# EAGLE design Thruster Ctl (EAGLE 6.6.0)
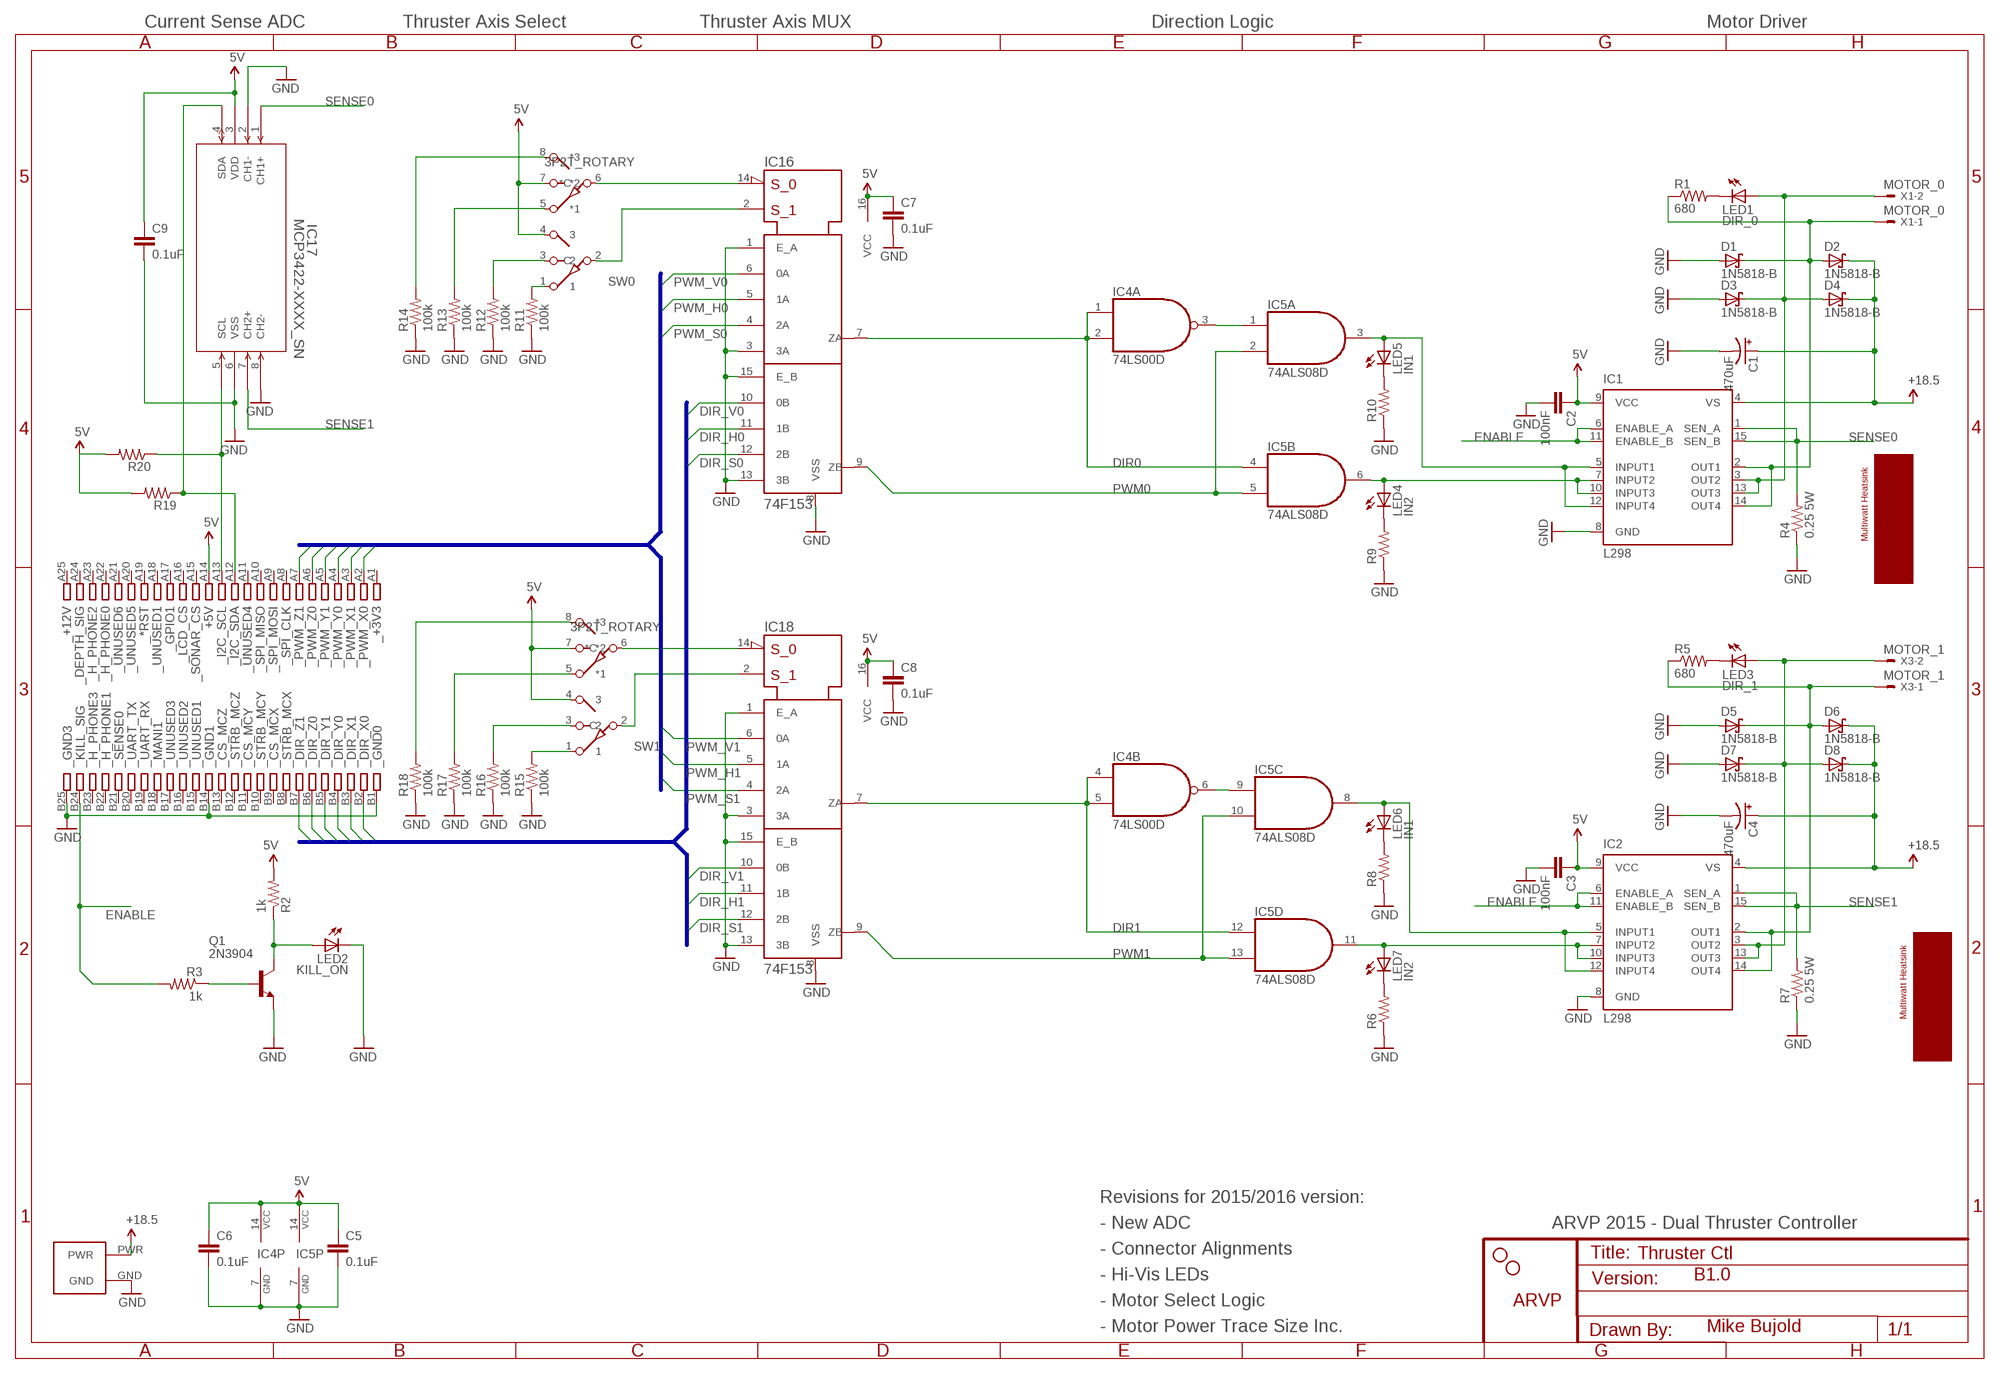
[diagram p0: schematic, sheet 1]

## Parts
C1  470uF  CPOL-USE25-10AXIAL  [E25-10]
C2  100nF  CAPPTH  [CAP-PTH-SMALL]
C3  100nF  CAPPTH  [CAP-PTH-SMALL]
C4  470uF  CPOL-USE25-10AXIAL  [E25-10]
C5  0.1uF  CAP1206  [1206]
C6  0.1uF  CAP1206  [1206]
C7  0.1uF  CAP1206  [1206]
C8  0.1uF  CAP1206  [1206]
C9  0.1uF  CAP1206  [1206]
D1  1N5818-B  [DO41-7.6]
D2  1N5818-B  [DO41-7.6]
D3  1N5818-B  [DO41-7.6]
D4  1N5818-B  [DO41-7.6]
D5  1N5818-B  [DO41-7.6]
D6  1N5818-B  [DO41-7.6]
D7  1N5818-B  [DO41-7.6]
D8  1N5818-B  [DO41-7.6]
IC1  L298  [MULTIWATT-15]
IC2  L298  [MULTIWATT-15]
IC4  74LS00D  [SO14]
IC5  74ALS08D  [SO14]
IC16  74F153  [SO16]
IC17  MCP3422-XXXX_SN  [SOIC8-N_MC]
IC18  74F153  [SO16]
JP1  STAND-OFF  [STAND-OFF]
JP4  STAND-OFF  [STAND-OFF]
LED1  DIR_0  LED5MM  [LED5MM]
LED2  KILL_ON  LED5MM  [LED5MM]
LED3  DIR_1  LED5MM  [LED5MM]
LED4  IN2  LEDSMT1206  [1206]
LED5  IN1  LEDSMT1206  [1206]
LED6  IN1  LEDSMT1206  [1206]
LED7  IN2  LEDSMT1206  [1206]
Q1  2N3904  [TO92]
R1  680  RESISTORPTH-1/4W  [AXIAL-0.4]
R2  1k  RESISTORPTH-1/4W  [AXIAL-0.4]
R3  1k  RESISTORPTH-1/4W  [AXIAL-0.4]
R4  0.25 5W  RESISTOR  [0922/22]
R5  680  RESISTORPTH-1/4W  [AXIAL-0.4]
R6  RESISTOR1206  [1206]
R7  0.25 5W  RESISTOR  [0922/22]
R8  RESISTOR1206  [1206]
R9  RESISTOR1206  [1206]
R10  RESISTOR1206  [1206]
R11  100k  RESISTOR1206  [1206]
R12  100k  RESISTOR1206  [1206]
R13  100k  RESISTOR1206  [1206]
R14  100k  RESISTOR1206  [1206]
R15  100k  RESISTOR1206  [1206]
R16  100k  RESISTOR1206  [1206]
R17  100k  RESISTOR1206  [1206]
R18  100k  RESISTOR1206  [1206]
R19  RESISTOR1206  [1206]
R20  RESISTOR1206  [1206]
SW0  3P2T_ROTARY  [DIL08]
SW1  3P2T_ROTARY  [DIL08]
U$4  ARVP_LOGO  [ARVP]
U$7  AND_PWR  [AND_PWR]
U$9  L298_HS  [HEATSINK_MW]
U$10  L298_HS  [HEATSINK_MW]
U$19  CARD_50PIN  [CARD_50PIN]
X1  MOTOR_0  KK-156-2  [KK-156-2]
X3  MOTOR_1  KK-156-2  [KK-156-2]

## Nets
5V: C2.1 C3.1 C5.1 C6.1 C7.1 C8.1 C9.1 IC1.9(VCC) IC2.9(VCC) IC4.14(P:VCC) IC5.14(P:VCC) IC16.16(VCC) IC17.3(VDD) IC18.16(VCC) R2.P$2 R19.2 R20.2 SW0.4 SW0.7(*2) SW1.4 SW1.7(*2) U$19.A14
18.5V: C1.+ C4.+ D2.C D4.C D6.C D8.C IC1.4(VS) IC2.4(VS) U$7.PWR ; supply symbol labelled +18.5
DIR0: IC4.1(A:I0) IC4.2(A:I1) IC5.4(B:I0) IC16.7(ZA)
DIR1: IC4.4(B:I0) IC4.5(B:I1) IC5.12(D:I0) IC18.7(ZA)
DIR_H0: IC16.11(1B) U$19.B4
DIR_H1: IC18.11(1B) U$19.B5
DIR_S0: IC16.12(2B) U$19.B6
DIR_S1: IC18.12(2B) U$19.B7
DIR_V0: IC16.10(0B) U$19.B2
DIR_V1: IC18.10(0B) U$19.B3
ENABLE: IC1.6(ENABLE_A) IC1.11(ENABLE_B) IC2.6(ENABLE_A) IC2.11(ENABLE_B) R3.P$2 U$19.B24
GND: C1.- C2.2 C3.2 C4.- C5.2 C6.2 C7.2 C8.2 C9.2 D1.A D3.A D5.A D7.A IC1.8(GND) IC2.8(GND) IC4.7(P:GND) IC5.7(P:GND) IC16.1(E_A) IC16.3(3A) IC16.8(VSS) IC16.13(3B) IC16.15(E_B) IC17.2(CH1-) IC17.6(VSS) IC17.8(CH2-) IC18.1(E_A) IC18.3(3A) IC18.8(VSS) IC18.13(3B) IC18.15(E_B) LED2.K(C) Q1.3(E) R4.1 R6.1 R7.1 R8.1 R9.1 R10.1 R11.1 R12.1 R13.1 R14.1 R15.1 R16.1 R17.1 R18.1 U$7.GND U$19.B1 U$19.B14 U$19.B25
N$1: IC16.14(S0) SW0.6(*C)
N$2: R13.2 SW0.5(*1)
N$3: LED2.A Q1.1(C) R2.P$1
N$4: IC2.5(INPUT1) IC2.12(INPUT4) IC5.8(C:O) LED6.A
N$5: IC1.5(INPUT1) IC1.12(INPUT4) IC5.3(A:O) LED5.A
N$6: IC1.7(INPUT2) IC1.10(INPUT3) IC5.6(B:O) LED4.A
N$7: D1.C D2.A IC1.2(OUT1) IC1.14(OUT4) R1.P$1 X1.1
N$8: D3.C D4.A IC1.3(OUT2) IC1.13(OUT3) LED1.A X1.2
N$9: LED1.K(C) R1.P$2
N$10: IC18.14(S0) SW1.6(*C)
N$11: D5.C D6.A IC2.2(OUT1) IC2.14(OUT4) R5.P$1 X3.1
N$12: D7.C D8.A IC2.3(OUT2) IC2.13(OUT3) LED3.A X3.2
N$13: R11.2 SW0.1
N$14: LED3.K(C) R5.P$2
N$15: IC16.2(S1) SW0.2(C)
N$16: IC18.2(S1) SW1.2(C)
N$18: LED7.C R6.2
N$19: LED6.C R8.2
N$20: LED4.C R9.2
N$21: LED5.C R10.2
N$22: IC17.5(SCL) R20.1 U$19.A13
N$23: IC17.4(SDA) R19.1 U$19.A12
N$24: R12.2 SW0.3
N$25: IC4.6(B:O) IC5.9(C:I0)
N$26: R14.2 SW0.8(*3)
N$27: IC4.3(A:O) IC5.1(A:I0)
N$28: Q1.2(B) R3.P$1
N$30: IC2.7(INPUT2) IC2.10(INPUT3) IC5.11(D:O) LED7.A
N$31: R17.2 SW1.5(*1)
N$32: R15.2 SW1.1
N$33: R16.2 SW1.3
N$34: R18.2 SW1.8(*3)
PWM0: IC5.2(A:I1) IC5.5(B:I1) IC16.9(ZB)
PWM1: IC5.10(C:I1) IC5.13(D:I1) IC18.9(ZB)
PWM_H0: IC16.5(1A) U$19.A4
PWM_H1: IC18.5(1A) U$19.A5
PWM_S0: IC16.4(2A) U$19.A6
PWM_S1: IC18.4(2A) U$19.A7
PWM_V0: IC16.6(0A) U$19.A2
PWM_V1: IC18.6(0A) U$19.A3
SENSE0: IC1.1(SEN_A) IC1.15(SEN_B) IC17.1(CH1+) R4.2
SENSE1: IC2.1(SEN_A) IC2.15(SEN_B) IC17.7(CH2+) R7.2
Unconnected: IC4.8(C:O) IC4.9(C:I0) IC4.10(C:I1) IC4.11(D:O) IC4.12(D:I0) IC4.13(D:I1) U$19.A1 U$19.A8 U$19.A9 U$19.A10 U$19.A11 U$19.A15 U$19.A16 U$19.A17 U$19.A18 U$19.A19 U$19.A20 U$19.A21 U$19.A22 U$19.A23 U$19.A24 U$19.A25 U$19.B8 U$19.B9 U$19.B10 U$19.B11 U$19.B12 U$19.B13 U$19.B15 U$19.B16 U$19.B17 U$19.B18 U$19.B19 U$19.B20 U$19.B21 U$19.B22 U$19.B23

## Buses
PWM_V0,PWM_V1,PWM_H0,PWM_H1,PWM_S0,PWM_S1
DIR_V0,DIR_V1,DIR_H0,DIR_H1,DIR_S0,DIR_S1

## Notes on the sheet
- Current Sense ADC | Thruster Axis Select | Thruster Axis MUX | Direction Logic | Motor Driver
- Revisions for 2015/2016 version:
- - New ADC | ARVP 2015 - Dual Thruster Controller
- - Connector Alignments
- - Hi-Vis LEDs | B1.0
- - Motor Select Logic
- - Motor Power Trace Size Inc. | Mike Bujold

## Library data of the parts
C1 C4 = rcl:CPOL-US: POLARIZED CAPACITOR, American symbol
C2 C3 = SparkFun:CAP: Capacitor Standard 0603 ceramic capacitor, and 0.1" leaded capacitor.
C5-C9 = SparkFun-Capacitors:CAP: Capacitor Standard 0603 ceramic capacitor, and 0.1" leaded capacitor.
D1-D8 = diode:1N581*: 1.0A SCHOTTKY BARRIER RECTIFIER Source: http://www.diodes.com/datasheets/ds23001.pdf
IC1 IC2 = st-microelectronics:L298: DUAL FULL-BRIDGE DRIVER; MPN: L298N; OC_FARNELL: 1589425; OC_NEWARK: 32M1527
IC4 = 74xx-us:74*00: Quad 2-input NAND gate
IC5 = 74xx-us:74*08: Quad 2-input AND gate
IC16 IC18 = ARVP:74F153
IC17 = MCP3426:MCP3422-XXXX_SN
JP1 JP4 = SparkFun:STAND-OFF: Stand Off This is the mechanical footprint for a #4 phillips button head screw. Use the keepout ring to avoid running the screw head into surrounding components. SKU : PRT-00447
LED1-LED3 = led:LED: LED
LED4-LED7 = adafruit:LED: LED
Q1 = transistor-npn:2N3904: NPN Transistor
R1-R3 R5 = SparkFun:RESISTOR: Resistor Basic schematic elements and footprints for 0603, 1206, and PTH resistors.
R4 R7 = virgin:RESISTOR
R6 R8-R20 = SparkFun-Passives:RESISTOR: Resistor Basic schematic elements and footprints for 0603, 1206, and PTH resistors.
SW0 SW1 = ARVP:3P2T_ROTARY
U$4 = ARVP:ARVP_LOGO
U$7 = ARVP:AND_PWR
U$9 U$10 = ARVP:L298_HS
U$19 = ARVP:CARD_50PIN
X1 X3 = con-molex:KK-156-2: KK 156 HEADER Source: http://www.molex.com/pdm_docs/sd/026604100_sd.pdf; OC_FARNELL: unknown; OC_NEWARK: unknown

## Board
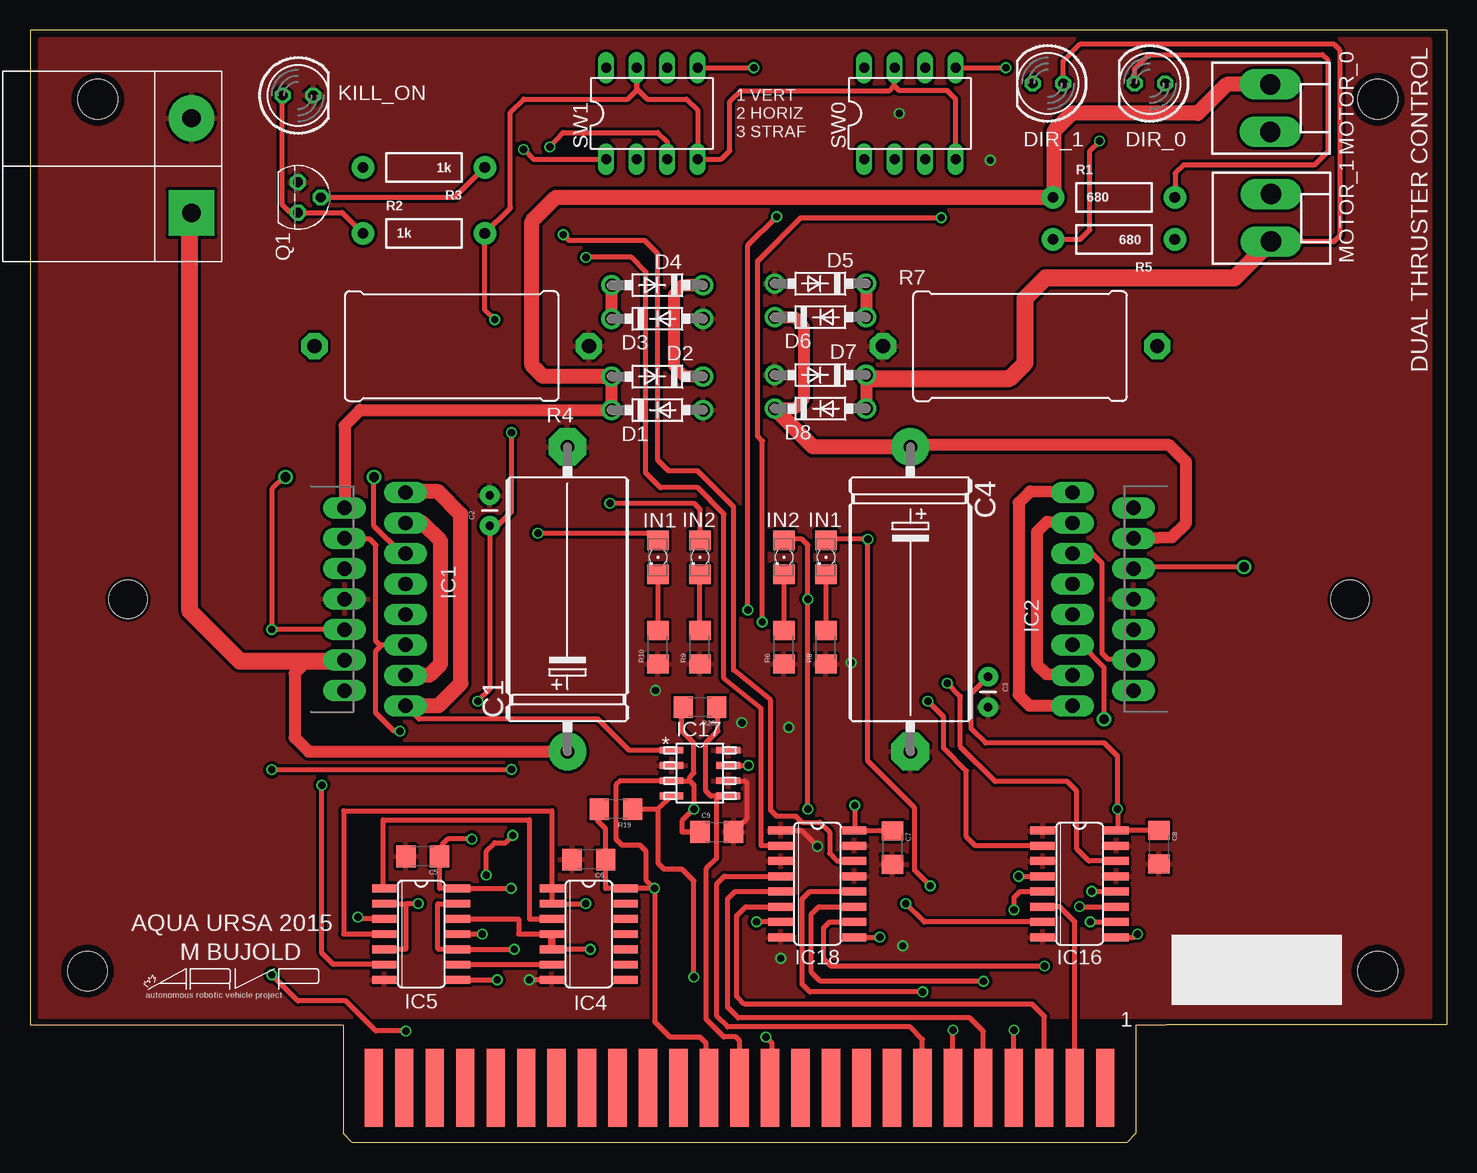
[diagram p1: board, top side]
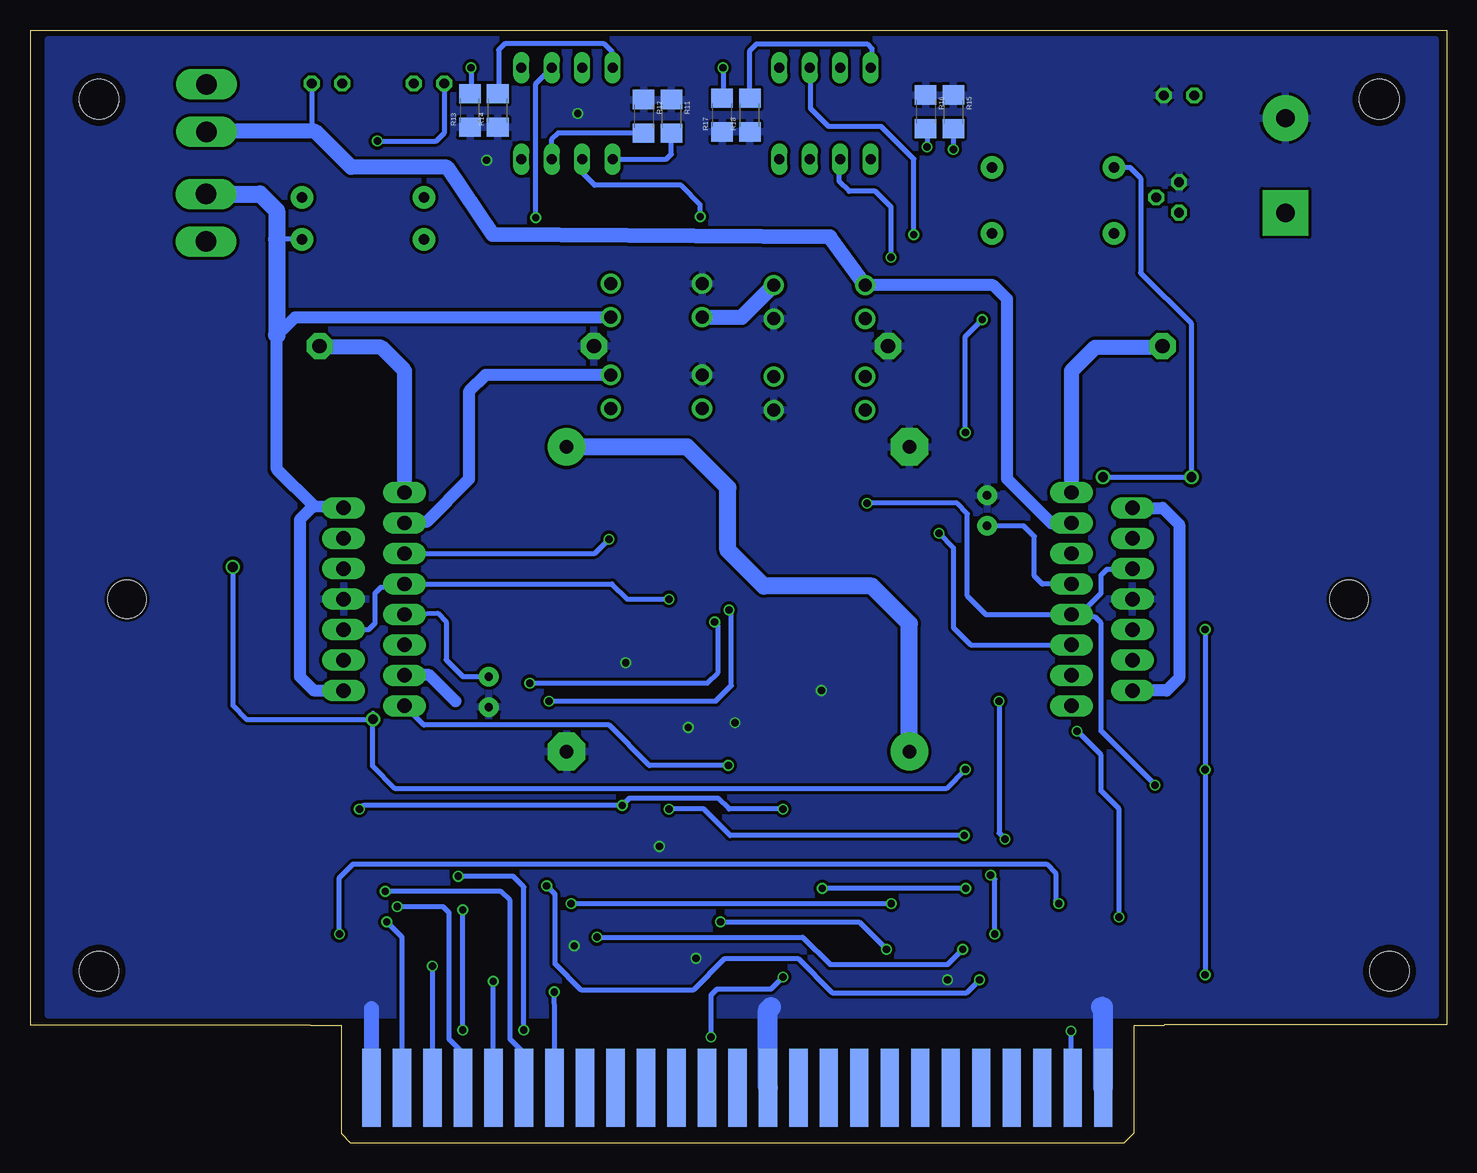
[diagram p2: board, bottom side, seen from below]

Size 118.08 x 92.75 mm. Coordinates in mm from the lower left corner, seen from the top.
Outline: 23.58,9.8 0.01,9.8 0,92.75 118.07,92.75 118.08,9.8 94.68,9.8
Copper layers (1*16): Top 0.035mm / dielectric 1.5mm / Bottom 0.035mm
Design rules "ITEADstudio_DRC": minimum track width 6mil, minimum drill 12mil, track to track 6mil, track to pad 6mil, pad to pad 6mil, via to via 6mil, smd to smd 0mil, copper to edge 10mil, drill to drill 10mil, minimum pad ring 10mil, minimum via ring 6mil, stop-mask expansion 2mil, vias tented up to drill 100mil, thermal gap 10mil

### Footprints (pad centres in the part's own frame; a part is rotated, then mirrored left to right if it is on the bottom)
E25-10 = drill 1.118 pad 3.15: + -12.7,0 | drill 1.118 pad 3.15 octagon: - 12.7,0
CAP-PTH-SMALL = drill 0.7 pad 1.651: 1 0,0; 2 2.54,0
1206 = smd 1.6 x 1.8: 1 -1.4,0; 2 1.4,0
DO41-7.6 = drill 1.1 pad 1.7: A 3.81,0; C -3.81,0
MULTIWATT-15 = drill 1.2 long: 1 -8.89,-7.62; 2 -7.62,-2.54; 3 -6.35,-7.62; 4 -5.08,-2.54; 5 -3.81,-7.62; 6 -2.54,-2.54; 7 -1.27,-7.62; 8 0,-2.54; 9 1.27,-7.62; 10 2.54,-2.54; 11 3.81,-7.62; 12 5.08,-2.54; 13 6.35,-7.62; 14 7.62,-2.54; 15 8.89,-7.62
SO14 = smd 0.66 x 2.032: 1 -3.81,-3.073; 2 -2.54,-3.073; 3 -1.27,-3.073; 4 0,-3.073; 5 1.27,-3.073; 6 2.54,-3.073; 7 3.81,-3.073; 8 3.81,3.073; 9 2.54,3.073; 10 1.27,3.073; 11 0,3.073; 12 -1.27,3.073; 13 -2.54,3.073; 14 -3.81,3.073
SO16 = smd 0.66 x 2.032: 1 -4.445,-3.073; 2 -3.175,-3.073; 3 -1.905,-3.073; 4 -0.635,-3.073; 5 0.635,-3.073; 6 1.905,-3.073; 7 3.175,-3.073; 8 4.445,-3.073; 9 4.445,3.073; 10 3.175,3.073; 11 1.905,3.073; 12 0.635,3.073; 13 -0.635,3.073; 14 -1.905,3.073; 15 -3.175,3.073; 16 -4.445,3.073
SOIC8-N_MC = smd 1.981 x 0.559: 1 -2.362,1.905; 2 -2.362,0.635; 3 -2.362,-0.635; 4 -2.362,-1.905; 5 2.362,-1.905; 6 2.362,-0.635; 7 2.362,0.635; 8 2.362,1.905
STAND-OFF = hole 3.302: 0,0
LED5MM = drill 0.813 octagon: A -1.27,0; K 1.27,0
1206' = smd 1.6 x 1.803: A -1.422,0; C 1.422,0
TO92 = drill 0.813 octagon: 1 1.27,0; 2 0,1.905; 3 -1.27,0
AXIAL-0.4 = drill 0.9 pad 1.88: P$1 -5.08,0; P$2 5.08,0
0922/22 = drill 1.2 pad 2.184 octagon: 1 -11.43,0; 2 11.43,0
DIL08 = drill 0.813 long: 1 -3.81,-3.81; 2 -1.27,-3.81; 3 1.27,-3.81; 4 3.81,-3.81; 5 3.81,3.81; 6 1.27,3.81; 7 -1.27,3.81; 8 -3.81,3.81
AND_PWR = drill 1.524 pad 3.81: GND 0,-7.886 | drill 1.524 pad 3.81 square: PWR 0,0
HEATSINK_MW = hole 3.2: 0,12.319
CARD_50PIN = smd 1.524 x 6.477: A1 30.48,5.08; A2 27.94,5.08; A3 25.4,5.08; A4 22.86,5.08; A5 20.32,5.08; A6 17.78,5.08; A7 15.24,5.08; A8 12.7,5.08; A9 10.16,5.08; A10 7.62,5.08; A11 5.08,5.08; A12 2.54,5.08; A13 0,5.08; A14 -2.54,5.08; A15 -5.08,5.08; A16 -7.62,5.08; A17 -10.16,5.08; A18 -12.7,5.08; A19 -15.24,5.08; A20 -17.78,5.08; A21 -20.32,5.08; A22 -22.86,5.08; A23 -25.4,5.08; A24 -27.94,5.08; A25 -30.48,5.08 | smd 1.524 x 6.477 bottom: B1 30.48,5.08; B2 27.94,5.08; B3 25.4,5.08; B4 22.86,5.08; B5 20.32,5.08; B6 17.78,5.08; B7 15.24,5.08; B8 12.7,5.08; B9 10.16,5.08; B10 7.62,5.08; B11 5.08,5.08; B12 2.54,5.08; B13 0,5.08; B14 -2.54,5.08; B15 -5.08,5.08; B16 -7.62,5.08; B17 -10.16,5.08; B18 -12.7,5.08; B19 -15.24,5.08; B20 -17.78,5.08; B21 -20.32,5.08; B22 -22.86,5.08; B23 -25.4,5.08; B24 -27.94,5.08; B25 -30.48,5.08
KK-156-2 = drill 1.7 pad 2.184 long: 1 -1.98,0; 2 1.98,0

### Placement (x,y rotation side)
C1  44.79,45.3 90 top
C2  38.31,51.41 90 top
C3  79.84,38.84 270 top
C4  73.37,45.3 270 top
C5  32.73,23.85 180 top
C6  46.57,23.6 180 top
C7  71.87,24.59 270 top
C8  94.07,24.63 270 top
C9  57.23,25.9 0 top
D1  52.28,61.06 0 top
D2  52.28,63.86 180 top
D3  52.28,68.68 0 top
D4  52.28,71.48 180 top
D5  65.87,71.61 180 top
D6  65.87,68.81 0 top
D7  65.87,63.99 180 top
D8  65.87,61.19 0 top
IC1  23.67,45.3 90 top
IC2  94.49,45.3 270 top
IC4  46.57,17.38 270 top
IC5  32.6,17.38 270 top
IC16  87.46,21.57 270 top
IC17  55.83,30.8 0 top
IC18  65.62,21.57 270 top
JP1  4.79,14.3 0 top
JP2  STAND-OFF  [STAND-OFF]  112.33,86.97 0 top
JP3  STAND-OFF  [STAND-OFF]  5.65,86.97 0 top
JP4  112.33,14.3 0 top
LED1  93.33,88.3 180 top
LED2  22.33,87.3 0 top
LED3  84.83,88.3 180 top
LED4  IN2  [1206']  55.83,48.8 270 top
LED5  IN1  [1206']  52.33,48.8 270 top
LED6  IN1  [1206']  66.33,48.8 270 top
LED7  IN2  [1206']  62.83,48.8 270 top
Q1  22.33,78.8 270 top
R1  90.33,78.8 0 top
R2  32.83,75.8 0 top
R3  32.83,81.3 180 top
R4  35.14,66.4 180 top
R5  90.33,75.3 180 top
R6  62.83,41.3 90 top
R7  82.51,66.4 0 top
R8  66.33,41.3 90 top
R9  55.83,41.3 90 top
R10  52.33,41.3 90 top
R11  64.63,85.55 270 bottom
R12  66.94,85.55 270 bottom
R13  81.41,86.04 90 bottom
R14  79.1,86.04 90 bottom
R15  41.13,85.93 270 bottom
R16  43.44,85.93 270 bottom
R17  60.4,85.66 90 bottom
R18  58.09,85.66 90 bottom
R19  48.83,27.8 180 top
R20  55.83,36.3 180 top
SW0  73.33,85.8 0 top
SW1  51.83,85.8 0 top
U$4  9.62,12.05 0 top
U$7  13.46,77.51 180 top
U$9  20.47,45.3 90 top
U$10  97.69,45.3 270 top
U$19  59.13,-0.51 0 top
X1  103.35,86.23 270 top
X3  103.41,77.09 270 top

### Tracks (layer width: path | path; a pad name or v marks a point on that pad's centre or on a via)
5V  (via drill 0.6)
  Top 0.406: v40.09,21.19 IC5.14 34.13,21.19 C5.1 34.33,24.05 34.33,24.8 34.83,25.3 v36.83,25.3 | 54.43,25.9 C9.1 54.33,25.9 54.33,26.8 v55.33,27.8 55.33,29.8 54.96,30.16 | v37.33,36.8 38.31,37.78 C2.1 38.94,51.41 40.13,52.6 v40.13,59.2 | R19.2 47.33,27.7 47.33,26.8 47.97,26.15 C6.1 47.97,21.19 IC4.14 v52.05,21.19 | v52.05,21.19 52.05,10.08 53.33,8.8 55.83,8.8 56.33,8.3 56.33,4.83 U$19.A14 | 54.96,30.16 IC17.3 49.19,30.16 48.83,29.8 48.83,25.3 49.33,24.8 50.83,24.8 51.33,24.3 51.33,21.91 v52.05,21.19 | 54.96,30.16 54.96,30.43 55.33,30.8 55.33,33.3 54.33,34.3 54.33,36.2 R20.2 | v68.73,28.1 68.73,26.05 IC18.16 68.72,25.99 C7.1 | C3.1 78.43,37.42 78.43,34.5 79.63,33.3 89.53,33.3 90.63,32.2 v90.63,27.8 90.63,26.1 IC16.16 90.56,26.03 C8.1 | v38.73,68.6 37.91,69.42 R2.P$2 40.03,77.92 40.03,85.9 41.13,87 49.83,87 50.56,87.73 SW1.7 50.56,87.87 51.43,87 54.73,87 55.63,86.1 SW1.4 57.62,81.99 58.33,82.7 58.33,86.8 59.23,87.7 71.63,87.7 72.03,88.1 | 72.03,88.1 72.03,89.58 SW0.7 | SW0.4 77.14,86.99 76.43,87.7 72.43,87.7 72.03,88.1
  Bottom 0.406: IC1.9 33.72,46.56 34.38,47.22 34.38,50.52 35.27,51.41 C2.1 | IC2.9 84.11,44.13 83.4,43.41 83.4,40.24 82,38.84 C3.1 | v40.09,21.19 v52.05,21.19 | v37.33,36.8 37.33,25.8 v36.83,25.3 | v55.33,27.8 59.83,27.8 60.73,28.7 68.13,28.7 v68.73,28.1 90.33,28.1 v90.63,27.8 | v40.13,59.2 40.13,67.2 v38.73,68.6
18.5V
  Top 1.016: IC1.4 26.21,40.11 23.07,40.11 22.06,39.09 22.06,33.76 23.23,32.59 C1.+ | D2.C 54.57,63.86 53.68,64.75 53.68,70.72 54.32,71.48 D4.C 54.7,71.48 | D6.C 63.71,68.81 64.48,68.05 64.48,61.95 63.71,61.19 D8.C | IC2.4 95.16,50.48 96.35,51.67 96.35,56.75 94.96,58.14 72.98,58.14 72.73,58.4 73.09,58.4 C4.+
  Top 1.27: C4.+ 65.26,58 D8.C
  Top 1.422: 26.21,40.11 17.51,40.11 13.33,44.3 13.33,77.38 U$7.PWR
  Bottom 0.406: 55.46,63.86 D2.C
  Bottom 1.27: D6.C 58.76,68.81 D4.C
  Bottom 1.422: C1.+ 44.79,43.26 47.93,46.4 56.93,46.4 59.93,49.4 59.93,54.6 63.33,58 C4.+
DIR0  (via drill 0.6)
  Top 0.406: IC5.4 26.15,17.38 26.15,27.66 43.5,27.66 IC4.1 IC4.2 v46.31,19.92 | IC16.7 74.51,18.39 v72.98,19.92
  Bottom 0.406: v46.31,19.92 v72.98,19.92
DIR1  (via drill 0.6)
  Top 0.406: IC5.12 40.73,18.65 40.73,17.38 IC4.4 | v46.7,16.11 IC4.5 | IC18.7 v60.54,18.39
  Top 0.61: IC4.5 IC4.4
  Bottom 0.406: v60.54,18.39 48.98,18.39 v46.7,16.11
DIR_H0  (via drill 0.6)
  Top 0.406: v87.46,19.66 IC16.11
  Bottom 0.406: U$19.B4 81.99,7.45 83.14,8.61 83.14,19.15 83.65,19.66 v87.46,19.66
DIR_H1  (via drill 0.6)
  Top 0.406: v79.46,13.44 65.87,13.44 65.11,14.2 65.11,19.03 65.75,19.66 IC18.11
  Bottom 0.406: U$19.B5 79.46,4.57 v79.46,13.44
DIR_S0  (via drill 0.6)
  Top 0.406: v88.48,20.93 IC16.12
  Bottom 0.406: U$19.B6 76.91,7.45 78.06,8.61 78.06,20.17 78.83,20.93 v88.48,20.93
DIR_S1  (via drill 0.6)
  Top 0.406: v74.38,12.55 64.98,12.55 64.35,13.19 64.35,20.3 64.98,20.93 IC18.12
  Bottom 0.406: U$19.B7 74.37,10.52 v74.38,12.55
DIR_V0  (via drill 0.6)
  Top 0.406: v88.35,18.39 IC16.10
  Bottom 0.406: U$19.B2 87.07,17.11 v88.35,18.39
DIR_V1  (via drill 0.6)
  Top 0.406: v84.54,14.71 66.76,14.71 66.13,15.34 66.13,17.88 66.63,18.39 IC18.10
  Bottom 0.406: U$19.B3 84.53,14.69 v84.54,14.71
ENABLE  (via drill 0.6, 0.8)
  Top 0.406: IC1.11 30.97,49.1 28.66,51.41 v28.66,55.48 | IC1.6 26.19,42.78 v20.15,42.78 20.15,54.46 21.17,55.48 v21.3,55.48 | IC2.11 87.51,41.59 89.49,39.6 v89.49,35.28 | v101.18,47.98 91.99,47.98 IC2.6 | v31.33,9.3 28.83,9.3 26.33,11.8 22.33,11.8 v20.15,13.97 | v20.15,31.08 v20.17,31.1 v40.13,31.1
  Bottom 0.406: v28.66,55.48 v21.3,55.48 21.33,55.51 21.33,68.3 25.53,72.5 25.53,80.4 26.43,81.3 R3.P$2 | v101.18,47.98 101.18,36.43 100.04,35.28 v89.49,35.28 89.49,35.8 89.53,35.76 89.53,31.4 87.63,29.5 41.73,29.5 v40.13,31.1 | U$19.B24 31.33,4.57 v31.33,9.3 | v20.15,42.78 v20.15,31.08 v20.15,13.97
GND  (via drill 0.6)
  Top 0.305: IC16.15 90.41,24.62
  Top 0.406: 84.41,17.1 IC16.8 | IC4.7 v41.62,13.57 | IC17.6 59.56,30.16 59.73,30 59.73,27 C9.2 | IC18.1 64.31,26.01 v65.63,24.7
  Bottom 1.27: U$19.B1 89.61,11.14 89.62,11.15
  Bottom 1.676: U$19.B25 28.65,11.3 28.83,11.3 | U$19.B14 56.59,11.04 56.33,11.3
  other vias: 62.57,15.34 72.73,16.4 72.43,85.8 80.03,81.9 52.13,37.7 68.43,40 63.23,34.6 59.33,35
  pour Bottom (isolate 0.254): 0.98,91.93 0.98,10.65 116.55,10.65 116.55,13.19 116.55,91.93
  pour Top (isolate 0.254): 0.85,91.93 0.85,10.52 116.67,10.52 116.67,91.93
N$1  (via drill 0.6)
  Top 0.406: IC16.14 88.25,23.47 87.23,24.5 87.23,29.3 86.43,30.1 80.43,30.1 77.53,33 77.53,37.2 v76.43,38.3 | v61.03,43.4 61.03,58.5 60.63,58.9 60.63,73.5 64.23,77.1 v75.93,77.1
  Bottom 0.406: v76.43,38.3 61.63,38.3 60.73,39.2 60.73,43.1 v61.03,43.4 | v75.93,77.1 75.93,88.28 SW0.6
N$2  (via drill 0.6)
  Top 0.406: SW0.5 v81.32,89.61 v81.33,89.6
  Bottom 0.406: v81.33,89.6 81.33,87.52 R13.2
N$3
  Top 0.406: R2.P$1 26.02,77.53 Q1.1 21.7,77.53 21.03,78.2 21.03,87.27 LED2.A
N$4  (via drill 0.6)
  Top 0.406: IC5.8 v38.95,13.57 | IC2.5 88.52,49.11 89.33,48.3 89.33,40.8 89.83,40.3 91.87,40.3 IC2.12 | v69.83,50.3 66.4,50.3 LED6.A | 69.93,50.4 v69.83,50.3 | v75.03,21.4 73.73,22.7 73.73,27.9 69.83,31.8 v69.83,50.3
  Bottom 0.406: IC2.5 71.02,49.11 v69.83,50.3 | v75.03,21.4 74.33,20.7 74.33,14.9 72.13,12.7 62.83,12.7 60.23,15.3 54.03,15.3 51.23,12.5 40.02,12.5 v38.95,13.57
N$5  (via drill 0.6)
  Top 0.406: v42.33,50.8 51.75,50.8 LED5.A | IC1.5 29.33,41.49 | 29.33,41.49 29.14,41.49 28.83,41.8 28.83,49.8 28.33,50.3 26.29,50.3 IC1.12 | IC5.3 27.47,18.65 v27.33,18.8 | v30.83,34.3 30.33,34.3 28.83,35.8 28.83,40.99 29.33,41.49
  Bottom 0.406: v42.33,50.8 41.11,49.58 41.11,42.9 39.69,41.48 IC1.5 | v27.33,18.8 27.33,27.8 28.83,29.3 28.83,32.3 v30.83,34.3
N$6  (via drill 0.6)
  Top 0.406: v48.33,53.3 55.33,53.3 55.83,52.8 LED4.A | IC5.6 25.28,14.84 24.33,15.8 v24.33,29.8
  Bottom 0.406: v48.33,53.3 40.83,53.3 39.96,52.43 39.96,45.57 38.42,44.02 IC1.7 | IC1.7 30.6,44.03 28.83,45.8 28.83,47.3 28.33,47.8 26.25,47.8 IC1.10 | v24.33,29.8 28.83,34.3 28.83,43.3 29.33,43.8 31.06,43.8 IC1.7
N$7
  Top 1.016: D2.A D1.C 27.52,61.06 26.21,59.76 IC1.14
  Top 1.27: D2.A 42.76,63.86 41.83,64.8 41.83,76.8 43.83,78.8 R1.P$1 85.33,78.88 85.33,84.3 86.83,85.8 97.33,85.8 99.74,88.21 X1.1
  Bottom 1.016: IC1.14 23.68,52.91 22.31,51.54 22.31,38.71 23.35,37.67 IC1.2
N$8
  Top 1.016: D3.C D4.A
  Top 1.27: IC1.3 33.26,38.94 34.23,39.91 34.23,50.13 32.7,51.66 31.31,51.66 IC1.13
  Bottom 0.406: LED1.A 94.6,84.57 94.33,84.3
  Bottom 0.813: 31.32,51.67 IC1.13
  Bottom 1.016: IC1.13 32.95,51.64 36.66,55.35 36.66,70.34 37.81,71.48 D4.A | 31.32,38.97 IC1.3
  Bottom 1.27: D4.A 48.47,71.44 51.43,75.5 79.53,75.7 83.33,81.3 91.33,81.3 94.33,84.3 103.31,84.3 X1.2
N$9
  Top 0.406: LED1.K 92.06,89.53 93.23,90.7 107.73,90.7 108.13,90.3 108.13,82.6 107.03,81.5 96.13,81.5 95.43,80.8 95.43,78.82 R1.P$2
N$10  (via drill 0.6)
  Top 0.406: v44.43,75.7 44.93,75.2 51.23,75.2 52.33,74.1 52.33,56.9 53.23,56 55.63,56 58.63,53 58.63,39.4 61.73,36.9 61.73,27.7 62.23,27.2 63.83,27.2 64.33,26.7 65.83,26.7 66.63,25.9 66.63,24.1 67.23,23.5 68.67,23.5 IC18.14
  Bottom 0.406: v44.43,75.7 44.43,82 47.13,84.7 51.53,84.7 53.03,86.2 53.03,89.54 SW1.6
N$11
  Top 1.016: D5.C D6.A | IC2.14 92.03,37.78
  Bottom 0.406: R5.P$1 97.53,75.3
  Bottom 1.016: IC2.14 92.03,37.7 94.45,37.7 95.59,38.84 95.59,51.92 94.49,53.02 IC2.2 94.4,53.02 97.5,56.11 97.5,67.29 95.97,68.81 D6.A
  Bottom 1.422: X3.1 98.9,79.07 97.53,77.7 97.53,75.3 97.53,67.32 97.5,67.29
N$12
  Top 0.406: LED3.A 86.1,90.17 87.53,91.6 108.63,91.6 109.13,91.1 109.13,75.6 108.63,75.1 103.42,75.1 X3.2
  Top 1.016: D7.C 69.68,63.71 D8.A | IC2.3 84.75,51.75 83.91,50.9 83.91,39.86 84.72,39.05 IC2.13
  Top 1.422: 69.68,63.71 81.64,63.71 82.93,65 82.93,70.4 84.63,72.1 100.39,72.1 X3.2
  Bottom 1.016: D7.C 80.1,63.99 81.49,62.59 81.49,55.3 85.05,51.75 IC2.3 | 82.64,36.81 84.8,38.97 86.79,38.97 IC2.13
N$13
  Bottom 0.406: SW0.1 65.04,81.99 64.63,82.4 R11.2
N$14  (via drill 0.6)
  Top 0.406: R5.P$2 87.53,75.3 88.33,76.1 88.33,82.7 v89.13,83.5
  Bottom 0.406: v89.13,83.5 84.23,83.5 83.53,84.2 83.53,88.27 LED3.K
N$15  (via drill 0.6)
  Top 0.406: IC16.2 78.78,24.74 78.03,25.5 78.03,31 76.13,32.9 76.13,35.5 v74.83,36.8 | v59.83,44.4 59.83,74.8 v62.23,77.2
  Bottom 0.406: v74.83,36.8 60.93,36.8 59.63,38.1 59.63,44.2 v59.83,44.4 | v62.23,77.2 62.23,78.2 63.83,79.8 71.03,79.8 72.03,80.8 72.03,81.96 SW0.2
N$16  (via drill 0.6)
  Top 0.406: IC18.2 60.93,24.74 60.93,36.2 57.83,38.7 57.83,52.4 55.63,54.6 52.53,54.6 51.33,55.8 51.33,72.6 50.13,73.8 v46.33,73.8
  Bottom 0.406: v46.33,73.8 46.33,78 47.63,79.3 49.83,79.3 50.63,80.1 50.63,81.92 SW1.2
N$18
  Top 0.406: LED7.C R6.2
N$19
  Top 0.406: LED6.C R8.2
N$20
  Top 0.406: R9.2 LED4.C
N$21
  Top 0.406: LED5.C R10.2
N$22
  Top 0.406: U$19.A13 59.13,8.5 58.83,8.8 57.83,8.8 56.33,10.3 56.33,22.8 57.23,23.7 57.23,28.89 | IC17.5 57.23,28.89 | 57.23,28.89 56.73,28.89 56.33,29.3 56.33,33.3 57.33,34.3 57.33,36.2 R20.1
N$23  (via drill 0.6)
  Top 0.406: IC17.4 52.33,27.75 | 52.33,27.75 52.33,23.3 52.83,22.8 54.33,22.8 55.33,21.8 v55.33,13.8 | v61.33,8.8 61.83,8.3 61.83,4.73 U$19.A12 | 52.33,27.75 50.27,27.75 R19.1
  Bottom 0.406: v61.33,8.8 61.33,12.3 60.83,12.8 56.33,12.8 v55.33,13.8
N$24
  Bottom 0.406: R12.2 74.07,84.15 74.63,83.6 74.63,82.02 SW0.3
N$25
  Top 0.406: IC5.9 IC4.6
N$26
  Bottom 0.406: SW0.8 69.52,90.89 70.23,91.6 78.53,91.6 79.03,91.1 79.03,87.51 R14.2
N$27
  Top 0.406: IC5.1 29.42,21.19 29.42,26.9 41.62,26.9 41.62,18.65 IC4.3
N$28
  Top 0.406: Q1.2 35.41,78.8 R3.P$1
N$30  (via drill 0.6)
  Top 0.406: IC5.11 v37.68,17.38 | LED7.A 62.9,50.3 64.33,50.3 64.83,49.8 v64.83,45.3 v64.83,27.8 | v38.03,22.3 38.03,24.3 38.73,25 39.63,25 v40.23,25.6
  Bottom 0.406: IC2.10 89.87,42.76 89.33,43.3 89.33,45.8 88.83,46.3 87.14,46.3 IC2.7 69.6,46.57 68.33,45.3 v64.83,45.3 | v37.68,17.38 37.68,21.95 v38.03,22.3 | v40.23,25.6 59.73,25.6 61.93,27.8 v64.83,27.8
N$31  (via drill 0.6)
  Top 0.406: SW1.5 v60.32,89.61 v60.33,89.6
  Bottom 0.406: v60.33,89.6 60.33,87.13 R17.2
N$32  (via drill 0.6)
  Top 0.406: v41.13,82.8 41.94,81.99 SW1.1
  Bottom 0.406: R15.2 v41.13,82.8
N$33  (via drill 0.6)
  Top 0.406: v43.33,83 44.43,84.2 52.33,84.2 53.1,83.43 SW1.3
  Bottom 0.406: R16.2 43.33,84.42 v43.33,83
N$34
  Bottom 0.406: R18.2 58.09,91.03 57.53,91.6 48.33,91.6 47.93,91.2 47.93,89.7 SW1.8
PWM0  (via drill 0.6)
  Top 0.406: IC5.2 31.33,19.92 | 31.33,19.92 31.33,16.11 IC5.5 | IC16.9 92.03,17.12 v92.29,17.38 | v32.34,19.92 31.33,19.92
  Bottom 0.406: v92.29,17.38 92.29,22.08 91.15,23.22 33.36,23.22 32.6,22.46 32.6,20.17 v32.34,19.92
PWM1  (via drill 0.6)
  Top 0.406: IC5.13 34,19.92 34,16.11 IC5.10 v40.35,16.11 | IC18.9 v70.83,17.12
  Bottom 0.406: v70.83,17.12 53.68,17.12 51.39,14.84 41.62,14.84 v40.35,16.11
PWM_H0  (via drill 0.6)
  Top 0.406: U$19.A4 81.99,9.36 v82,9.38 | v82,19.41 82,20.42 82.51,20.93 IC16.5
  Bottom 0.406: v82,9.38 v82,19.41
PWM_H1
  Top 0.406: U$19.A5 79.45,9.26 78.32,10.39 59.01,10.39 58.13,11.28 58.13,20.3 58.76,20.93 IC18.5
PWM_S0  (via drill 0.6)
  Top 0.406: U$19.A6 76.91,9.36 v76.92,9.38 | v82.38,22.2 IC16.4
  Bottom 0.406: v76.92,9.38 76.92,21.31 77.81,22.2 v82.38,22.2
PWM_S1
  Top 0.406: U$19.A7 74.37,8.61 73.37,9.63 58.13,9.63 57.24,10.52 57.24,21.57 57.87,22.2 IC18.4
PWM_V0
  Top 0.406: U$19.A2 87.07,18.41 85.81,19.66 IC16.6
PWM_V1
  Top 0.406: U$19.A3 84.53,10.53 83.53,11.53 59.52,11.53 58.89,12.17 58.89,18.9 59.65,19.66 IC18.6
SENSE0
  Top 0.305: 31.27,54.2 IC1.15
  Top 0.406: IC17.1 49.92,32.7 47.33,35.3 32.4,35.3 IC1.1
  Top 1.016: 31.36,54.25 IC1.15
  Top 1.27: IC1.1 34.03,36.4 35.91,38.28 35.91,52.37 34.02,54.25 31.36,54.25
  Bottom 1.016: 31.27,54.2 IC1.15
  Bottom 1.27: 31.27,54.2 31.27,64.35 29.33,66.3 23.81,66.3 R4.2
SENSE1  (via drill 0.6)
  Top 0.406: IC17.7 v59.88,31.45
  Top 1.016: IC2.1 83.35,54.29 82.38,53.32 82.38,37.32 83.27,36.43 86.79,36.43 IC2.15
  Bottom 0.406: IC2.15 85.26,34.8 69.83,34.8 66.46,31.43 v59.88,31.45
  Bottom 1.27: IC2.1 86.87,64.34 88.83,66.3 93.84,66.3 R7.2

### Text on the board
tNames: DUAL THRUSTER CONTROL | 1 VERT / 2 HORIZ / 3 STRAF | AQUA URSA 2015 | M BUJOLD